# EAGLE schematic sht21-breakout_v2 (EAGLE 7.2.0)
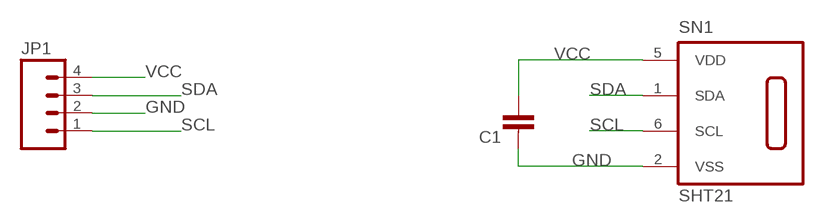
[diagram p0: schematic, sheet 1]

## Parts
C1  CAPACITOR0603-N  [C0603-N]
JP1  M04LONGPADS  [1X04_LONGPADS]
SN1  SHT21  [DFN6/SHT]

## Nets
GND: C1.1 JP1.2 SN1.2(VSS)
SCL: JP1.1 SN1.6(SCL)
SDA: JP1.3 SN1.1(SDA)
VCC: C1.2 JP1.4 SN1.5(VDD)

## Library data of the parts
C1 = passives-7351:CAPACITOR
JP1 = SparkFun-Connectors:M04: Header 4 Standard 4-pin 0.1" header. Use with straight break away headers (SKU : PRT-00116), right angle break away headers (PRT-00553), swiss pins (PRT-00743), machine pins (PRT-00117), and female headers (PRT-00115). Molex polarized connector foot print use with SKU : PRT-08231 with associated crimp pins and housings. 1MM SMD Version SKU: PRT-10208
SN1 = sensirion:SHT21: Humidity and Temperature Sensor